# Altium schematic sheet Power.SchDoc
size A4; SheetNumber: 5; SheetTotal: 5
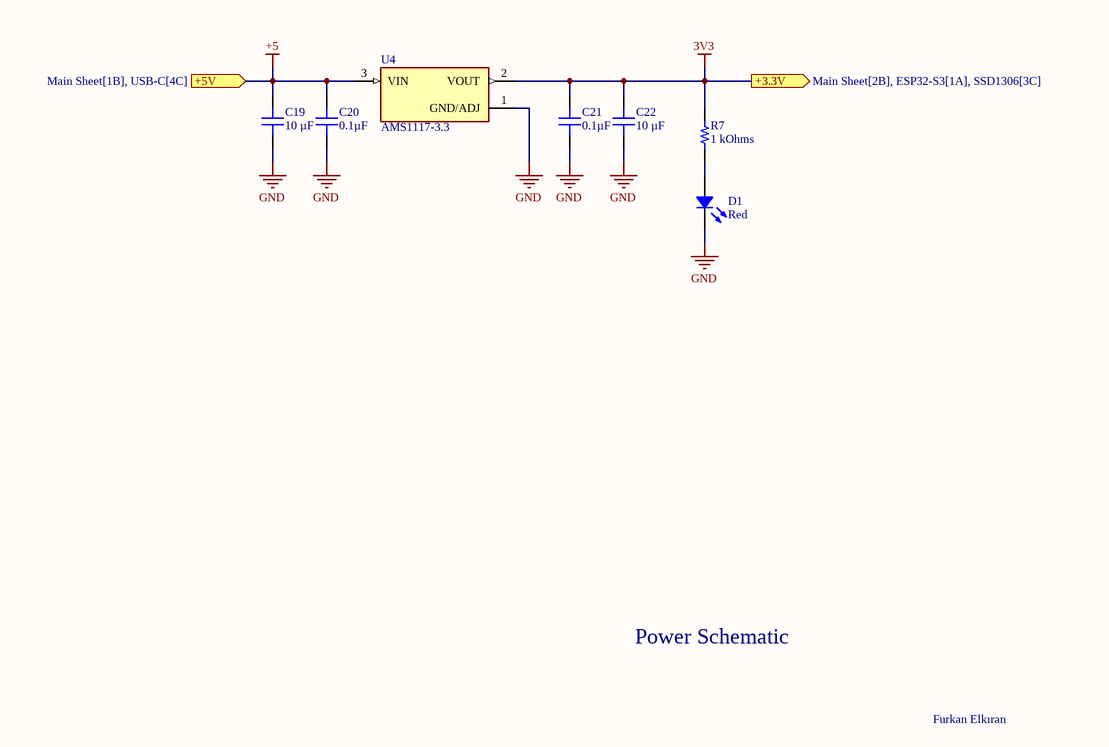
[diagram p0: Power.SchDoc]

## Parts
C19  10 µF  [CAP 0805_2012]
C20  0.1µF  [CAP 0805_2012]
C21  0.1µF  [CAP 0805_2012]
C22  10 µF  [CAP 0805_2012]
D1  Red  [LED 0603_1608 RED]
R7  1 kOhms  [RES 0402_1005]
U4  AMS1117-3.3  [SOT229P700X180-4N]

## Ports
+3.3V (out, see Main Sheet[2B], ESP32-S3[1A], SSD1306[3C]), +5V (in, see Main Sheet[1B], USB-C[4C])

## Nets
3V3: C21.2 C22.2 R7.2 U4.2(VOUT) ; port +3.3V
+5: C19.2 C20.2 U4.3(VIN) ; port +5V
GND: C19.1 C20.1 C21.1 C22.1 D1.2 U4.1(GND/ADJ)
NetD1_1: D1.1 R7.1

## Notes on the sheet
- Power Schematic
- Furkan Elkıran

## Library data of the parts
C19 C22 = CL21X106KAYNNNE: CAP CER 10UF 25V X6S 0805; manufacturer: Samsung Electro-Mechanics; Tolerance: ±10%; Part Number: CL21X106KAYNNNE; Capacitance: 10 µF; Applications: General Purpose; componentlink1description: Datasheet; componentlink1url: http://www.samsungsem.com/kr/support/product-search/mlcc/CL21X106KAYNNNE.jsp; componentlink2description: DigiKey Link; componentlink2url: https://www.digikey.com/en/products/detail/samsung-electro-mechanics/CL21X106KAYNNNE/5961182; Device Package: 0805 (2012 Metric); lastupdated: 9.02.2024 20:16:03; Lifecycle Status: Active; Minimum Order: 1; Mounting Type: Surface Mount, MLCC; Operating Temperature: -55°C ~ 105°C; Package / Case: 0805 (2012 Metric); packaging: TapeAndReel; partid: 4781; Part Status: Active; price: 0.04; series: CL; Size / Dimension: 0.079" L x 0.049" W (2.00mm x 1.25mm); Supplier 1: DigiKey; Supplier Part Number 1: 1276-6698-1-ND; Temperature Coefficient: X6S; Thickness (Max): 0.057" (1.45mm); value: 10 µF; Voltage - Rated: 25V
C20 C21 = LD055C104KAB2A: CAP CER 0.1UF 50V X7R 0805; manufacturer: AVX Corporation; Tolerance: ±10%; Part Number: LD055C104KAB2A; Capacitance: 0.1µF; Applications: General Purpose; componentlink1description: Datasheet; componentlink1url: http://datasheets.avx.com/LD-Series.pdf; componentlink2description: DigiKey Link; componentlink2url: http://digikey.com/product-detail/en/avx-corporation/LD055C104KAB2A/478-4931-1-ND/1858877; Device Package: 0805 (2012 Metric); lastupdated: 2.09.2020 01:04:40; Lifecycle Status: Active; Minimum Order: 1; Mounting Type: Surface Mount, MLCC; Operating Temperature: -55°C ~ 125°C; Package / Case: 0805 (2012 Metric); packaging: TapeAndReel; partid: 3356; Part Status: Active; price: 0.16; series: LD; Size / Dimension: 0.079" L x 0.049" W (2.01mm x 1.25mm); Supplier 1: DigiKey; Supplier Part Number 1: 478-4931-1-ND; Temperature Coefficient: X7R; Thickness (Max): 0.037" (0.94mm); value: 0.1µF; Voltage - Rated: 50V
D1 = QBLP601-R1: 0603 LED RED 623NM DOMINANT, 628; Manufacturer: QT Brightek (QTB); Configuration: Standard; Current - Test: 20mA; Lens Color: Colorless; Lens Size: 1.10mm x 0.80mm; Lens Style: Rectangle with Flat Top; Lens Transparency: Clear; Millicandela Rating: 9mcd; Viewing Angle: 140°; Voltage - Forward (Vf) (Typ): 2V; Wavelength - Peak: 628nm; Part Number: QBLP601-R1; Color: Red; ComponentLink1Description: Datasheet; ComponentLink1URL: https://www.qt-brightek.com/datasheet/QBLP601-R1.pdf; ComponentLink2Description: DigiKey Link; ComponentLink2URL: https://www.digikey.com/en/products/detail/qt-brightek-qtb/QBLP601-R1/22106643; Device Package: 0603 (1608 Metric); Height (Max): 0.70mm; LastUpdated: 3.06.2024 19:59:37; Lifecycle Status: Active; Minimum Order: 1; Mounting Type: Surface Mount; Package / Case: 0603 (1608 Metric); Packaging: TapeAndReel; PartId: 1462; Price: 0.06; Series: QBLP601; Size / Dimension: 1.60mm L x 0.80mm W; Supplier 1: DigiKey; Supplier Part Number 1: 1516-QBLP601-R1CT-ND; Supplier Device Package: 0603; Value: Red; Wavelength - Dominant: 623nm
R7 = CRCW04021K00JNEDHP: RES SMD 1K OHM 5% 1/5W 0402; Manufacturer: Vishay Dale; Power (Watts): 0.2W, 1/5W; Temperature Coefficient: ±200ppm/°C; Part Number: CRCW04021K00JNEDHP; Value: 1 kOhms; ComponentLink1Description: Datasheet; ComponentLink1URL: http://www.vishay.com/docs/20043/crcwhpe3.pdf; ComponentLink2Description: DigiKey Link; ComponentLink2URL: https://www.digikey.com/en/products/detail/vishay-dale/CRCW04021K00JNEDHP/2222560; Composition: Thick Film; Device Package: 0402 (1005 Metric); Features: Automotive AEC-Q200, Pulse Withstanding; Height - Seated (Max): 0.016" (0.40mm); LastUpdated: 9.02.2024 20:30:06; Lifecycle Status: Active; Minimum Order: 1; Number of Terminations: 2; Operating Temperature: -55°C ~ 155°C; Package / Case: 0402 (1005 Metric); Packaging: TapeAndReel; PartId: 6693; Part Status: Active; Price: 0.01; Ratings: AEC-Q200; Resistance: 1 kOhms; Series: CRCW-HP; Size / Dimension: 0.039" L x 0.020" W (1.00mm x 0.50mm); Supplier 1: DigiKey; Supplier Part Number 1: 541-1.0KYACT-ND; Supplier Device Package: 0402; Tolerance: ±5%
U4 = AMS1117-3.3: Sot223/Pkg 1-Amp 3.3-Volt Low Drop Out Voltage Regulatator; MF: Advanced Monolithic Systems; SnapEDA_Link: https://www.snapeda.com/parts/AMS1117-3.3/Advanced+Monolithic+Systems/view-part/?ref=snap; Package: SOT-223 Seeed Technology; Value: *; MP: AMS1117-3.3; Check_prices: https://www.snapeda.com/parts/AMS1117-3.3/Advanced+Monolithic+Systems/view-part/?ref=eda